# EAGLE schematic ventilator_circuit (EAGLE 9.6.2)
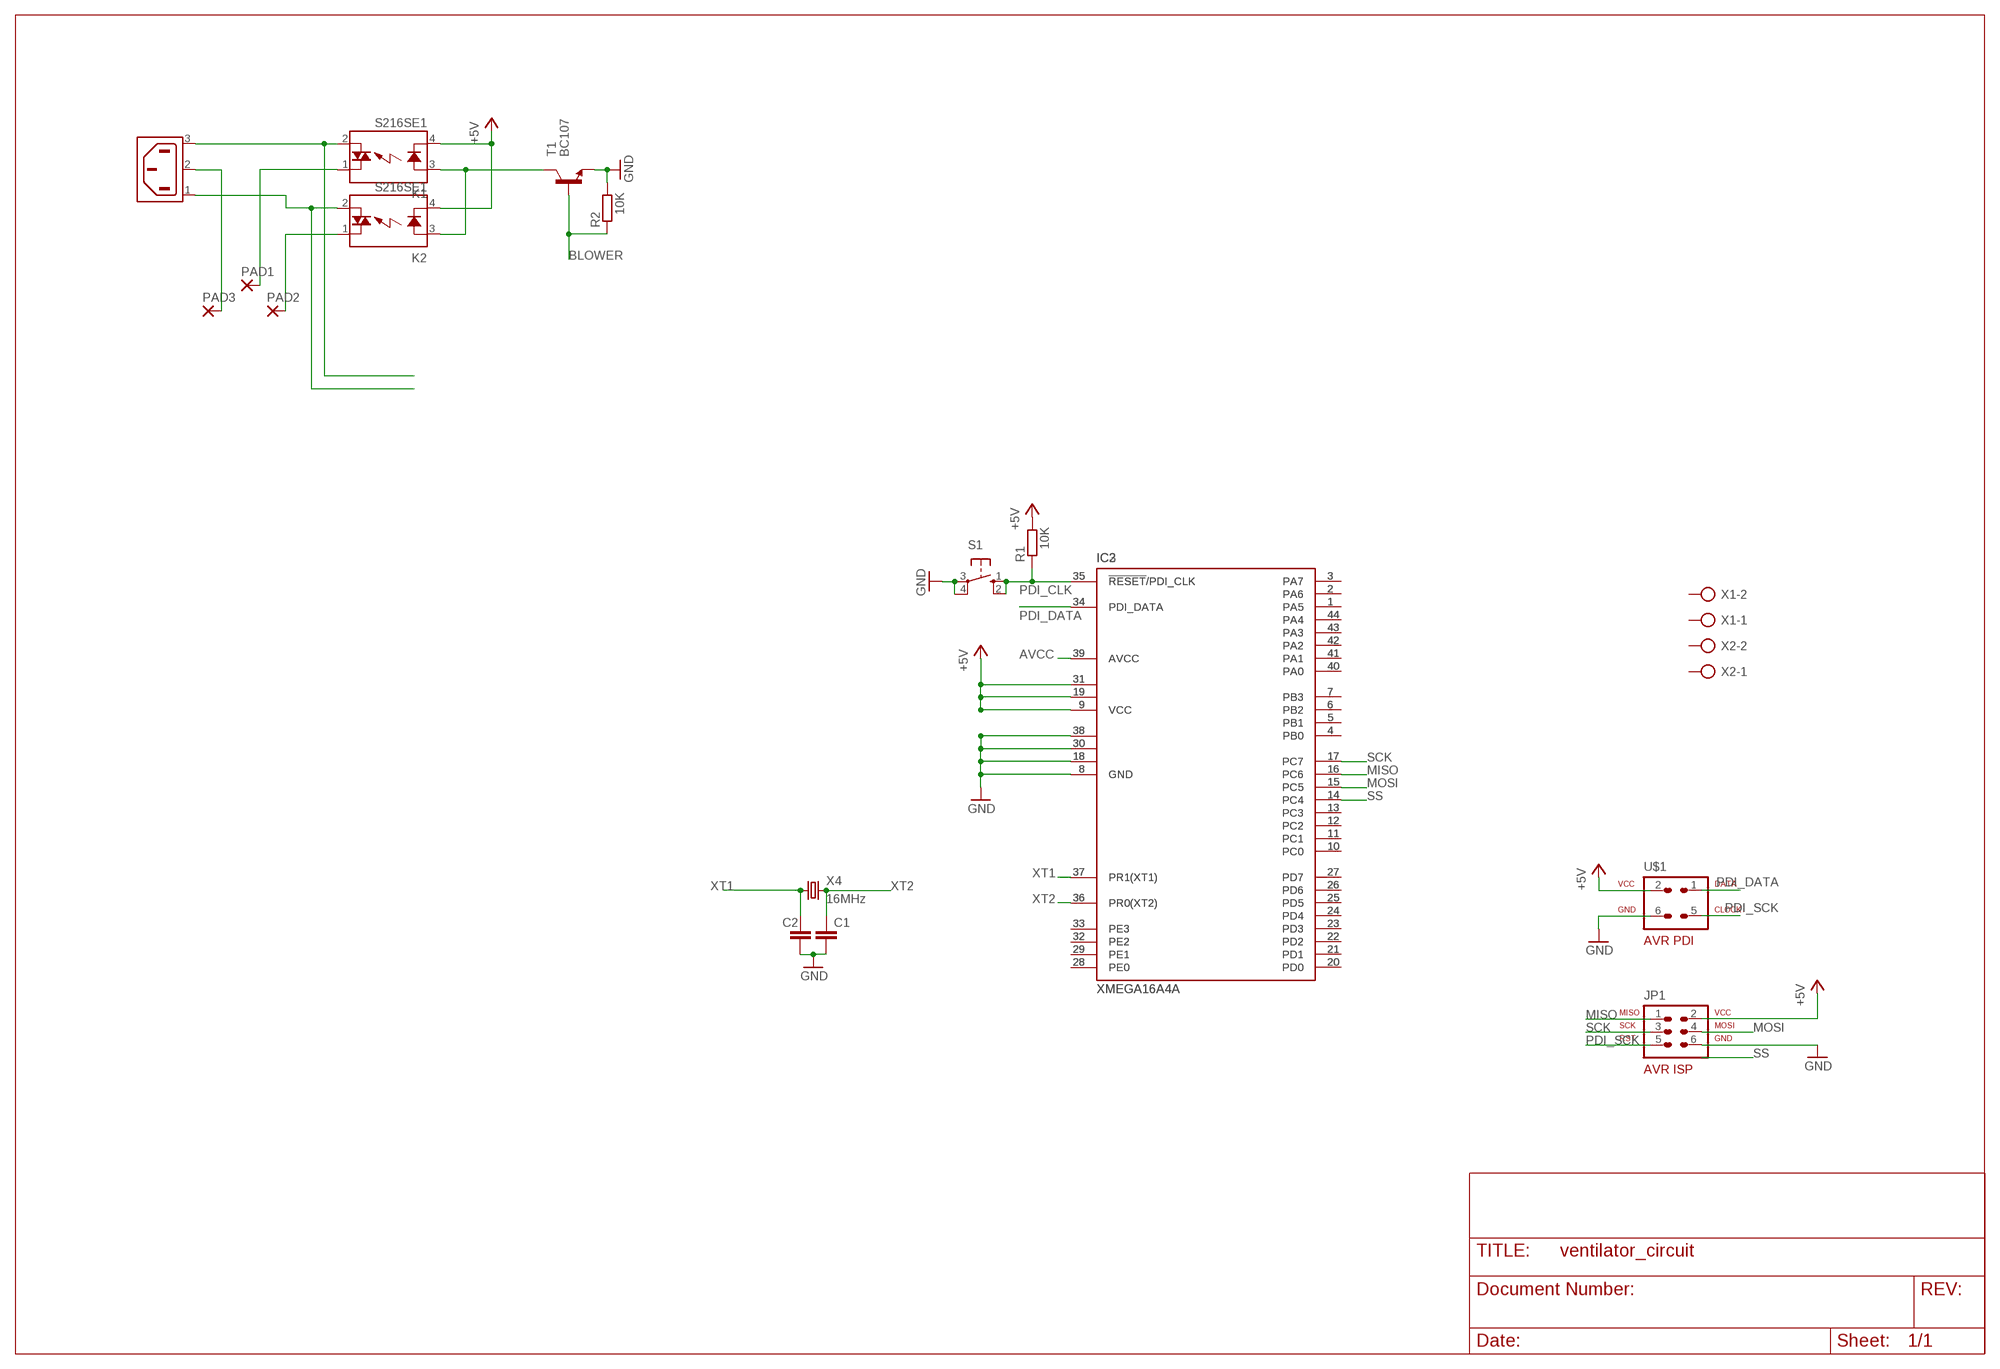
[diagram p0: schematic, sheet 1]

## Parts
C1  C-EU025-025X050  [C025-025X050]
C2  C-EU025-025X050  [C025-025X050]
IC2  XMEGA16A4A  [TQFP44]
IC3  XMEGA16A4A  [TQFP44]
JP1  AVR-ISP-6VERT  [AVR-ISP-6]
K1  S216SE1  [S2XXEX]
K2  S216SE1  [S2XXEX]
PAD1  3,81/1,4  [3,81/1,4]
PAD2  3,81/1,4  [3,81/1,4]
PAD3  3,81/1,4  [3,81/1,4]
R1  10K  R-EU_R0805  [R0805]
R2  10K  R-EU_R0805  [R0805]
S1  10-XX  [B3F-10XX]
T1  BC107  [TO18]
U$1  AVR-PDIVERT  [AVR-ISP-6]
X1  AK500/2  [AK500/2]
X2  AK500/2  [AK500/2]
X3  6ESRM-P  [6ESRM-P]
X4  16MHz  CRYSTALS-NOGND-HC49/4H  [HC49]

## Nets
+5V: IC2.9(VCC) IC2.19(VCC1) IC2.31(VCC2) IC3.9(VCC) IC3.19(VCC1) IC3.31(VCC2) JP1.2 K1.4(K) K2.4(K) R1.2 U$1.2
AVCC: IC2.39(AVCC) IC3.39(AVCC)
BLOWER: R2.1 T1.2(B)
GND: C1.2 C2.2 IC2.8(GND) IC2.18(GND1) IC2.30(GND2) IC2.38(GND3) IC3.8(GND) IC3.18(GND1) IC3.30(GND2) IC3.38(GND3) JP1.6 R2.2 S1.3(P) S1.4(P1) T1.1(E) U$1.6
MISO: IC2.16(PC6) IC3.16(PC6) JP1.1
MOSI: IC2.15(PC5) IC3.15(PC5) JP1.4
N$1: IC2.28(PE0) IC3.28(PE0)
N$3: IC2.29(PE1) IC3.29(PE1)
N$4: IC2.32(PE2) IC3.32(PE2)
N$5: IC2.33(PE3) IC3.33(PE3)
N$6: IC2.27(PD7) IC3.27(PD7)
N$7: IC2.26(PD6) IC3.26(PD6)
N$8: IC2.25(PD5) IC3.25(PD5)
N$9: IC2.24(PD4) IC3.24(PD4)
N$10: IC2.23(PD3) IC3.23(PD3)
N$11: IC2.22(PD2) IC3.22(PD2)
N$12: IC2.21(PD1) IC3.21(PD1)
N$13: IC2.20(PD0) IC3.20(PD0)
N$14: PAD3.1(P) X3.2(SH)
N$15: K1.2(DS2) X3.3(AC2)
N$16: K2.2(DS2) X3.1(AC1)
N$17: K1.1(DS1) PAD1.1(P)
N$18: IC2.13(PC3) IC3.13(PC3)
N$19: IC2.12(PC2) IC3.12(PC2)
N$20: IC2.11(PC1) IC3.11(PC1)
N$21: IC2.10(PC0) IC3.10(PC0)
N$22: IC2.7(PB3) IC3.7(PB3)
N$23: IC2.6(PB2) IC3.6(PB2)
N$24: IC2.5(PB1) IC3.5(PB1)
N$25: IC2.4(PB0) IC3.4(PB0)
N$26: IC2.2(PA6) IC3.2(PA6)
N$27: IC2.3(PA7) IC3.3(PA7)
N$28: IC2.1(PA5) IC3.1(PA5)
N$29: IC2.44(PA4) IC3.44(PA4)
N$30: IC2.43(PA3) IC3.43(PA3)
N$31: IC2.42(PA2) IC3.42(PA2)
N$32: IC2.41(PA1) IC3.41(PA1)
N$33: IC2.40(PA0) IC3.40(PA0)
N$34: K2.1(DS1) PAD2.1(P)
N$35: K1.3(A) K2.3(A) T1.3(C)
PDI_CLK: IC2.35(!RESET!/PDI_CLK) IC3.35(!RESET!/PDI_CLK) R1.1 S1.1(S) S1.2(S1)
PDI_DATA: IC2.34(PDI_DATA) IC3.34(PDI_DATA) U$1.1
PDI_SCK: JP1.5 U$1.5
SCK: IC2.17(PC7) IC3.17(PC7) JP1.3
SS: IC2.14(PC4) IC3.14(PC4)
XT1: C2.1 IC2.37(PR1(XT1)) IC3.37(PR1(XT1)) X4.1
XT2: C1.1 IC2.36(PR0(XT2)) IC3.36(PR0(XT2)) X4.2
Unconnected: X1.1 X1.2 X2.1 X2.2

## Library data of the parts
C1 C2 = rcl:C-EU: CAPACITOR, European symbol; SPICEPREFIX: C
IC2 IC3 = atmel:XMEGA16A4: MICROCONTROLLER Features High-performance, Low-power 8/16-bit AVR XMEGA Microcontroller Non-Volatile Program and Data Memories - 16 KB - 128 KB of In-System Self-Programmable Flash - 4 KB - 8 KB Boot Code Section with Independent Lock Bits - 1 KB - 2 KB EEPROM - 2 KB - 8 KB Internal SRAM Peripheral Features - Four-channel DMA Controller with support for external requests - Eight-channel Event System - Five 16-bit Timer/Counters Three Timer/Counters with 4 Output Compare or Input Capture channels Two Timer/Counters with 2 Output Compare or Input Capture channels High-Resolution Extensions on all Timer/Counters Advanced Waveform Extension on one Timer/Counter - Five USARTs IrDA Extension on one USART - Two Two-Wire Interfaces with dual address match (I2C and SMBus compatible) - Two SPIs (Serial Peripheral Interfaces) peripherals - AES and DES Crypto Engine - 16-bit Real Time Counter with Separate Oscillator - One Twelve-channel, 12-bit, 2 Msps Analog to Digital Converter - One Two-channel, 12-bit, 1 Msps Digital to Analog Converter - Two Analog Comparators with Window compare function - External Interrupts on all General Purpose I/O pins - Programmable Watchdog Timer with Separate On-chip Ultra Low Power Oscillator Special Microcontroller Features - Power-on Reset and Programmable Brown-out Detection - Internal and External Clock Options with PLL - Programmable Multi-level Interrupt Controller - Sleep Modes: Idle, Power-down, Standby, Power-save, Extended Standby - Advanced Programming, Test and Debugging Interfaces PDI (Program and Debug Interface) for programming, test and debugging I/O and Packages - 34 Programmable I/O Lines - 44 - lead TQFP - 44 - pad VQFN/QFN - 49 - ball VFBGA Operating Voltage - 1.6 - 3.6V Speed performance - 0 - 12 MHz @ 1.6 - 3.6V - 0 - 32 MHz @ 2.7 - 3.6V Drawn by Dipl.-Ing. (FH) Robert Siegler Created: 27.05.09; OC_FARNELL: unknown; OC_NEWARK: unknown
JP1 = avr-7:AVR-ISP-6: AVR ISP-6 Serial Programming Header
K1 K2 = relay:S2*: SIP Type SSR for Medium Power Control SHARP Source: 168149-da-01-en-Solid_State_Relais_S_202_SE1_SE2.pdf; OC_FARNELL: unknown; OC_NEWARK: unknown
PAD1-PAD3 = wirepad:3,81/1,4: THROUGH-HOLE PAD
R1 R2 = rcl:R-EU_: RESISTOR, European symbol; SPICEPREFIX: R
S1 = switch-omron:10-XX: OMRON SWITCH; MPN: B3F-1000; OC_FARNELL: 176432; OC_NEWARK: 36M3542
T1 = transistor:BC107: NPN TRANSISTOR
U$1 = avr-7:AVR-PDI: AVR PDI programming interface connector
X1 X2 = con-ptr500:AK500/2: CONNECTOR; OC_FARNELL: unknown; OC_NEWARK: unknown
X3 = con-tycoelectronics:6ESRM-P: AC Connector 120/250 VAC Source: http://catalog.tycoelectronics.com .. ENG_DS_1654001_1099_SR_0406.pdf; MF: TYCO ELECTRONICS; MPN: 6ESRM-P; OC_FARNELL: unknown; OC_NEWARK: 87F1821
X4 = IQD-Frequency-Products:CRYSTALS-NOGND: CRYSTALS CAN NOT GROUNDED